# EAGLE design FrontPanel4 (EAGLE 9.2.2)
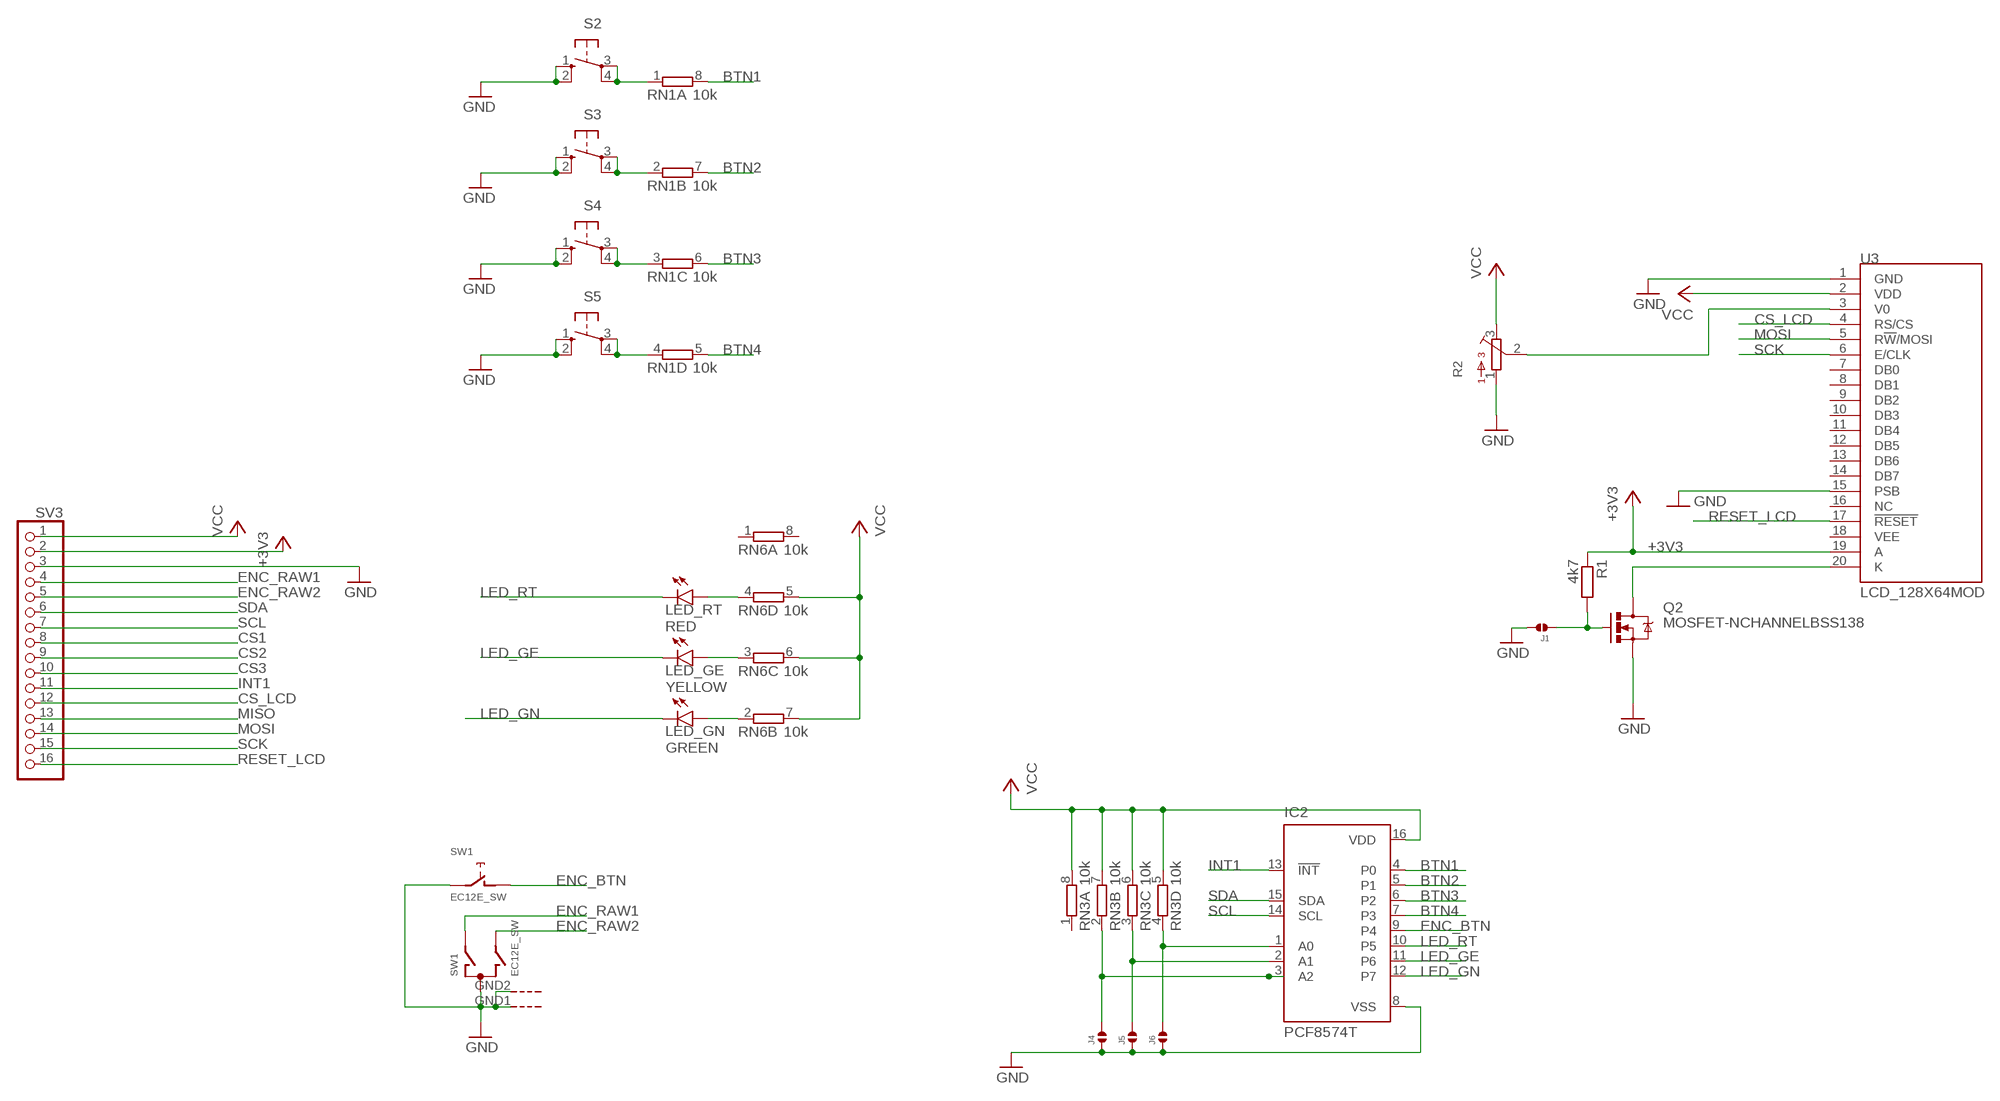
[diagram p0: schematic, sheet 1]

## Parts
IC2  PCF8574T  [SO16W]
J1  SOLDERJUMPER.2.MED  [2.MED]
J4  SOLDERJUMPER.2.MED  [2.MED]
J5  SOLDERJUMPER.2.MED  [2.MED]
J6  SOLDERJUMPER.2.MED  [2.MED]
LED_GE  YELLOW  LED5MM  [LED5MM]
LED_GN  GREEN  LED5MM  [LED5MM]
LED_RT  RED  LED5MM  [LED5MM]
Q2  MOSFET-NCHANNELBSS138  [SOT23]
R1  4k7  R-EU_R1206  [R1206]
R2  3362P  [3362P]
RN1  10k  4R-N0603-ARC  [0603-ARC]
RN3  10k  4R-N0603-ARC  [0603-ARC]
RN6  10k  4R-N0603-ARC  [0603-ARC]
S2  10-XX  [B3F-10XX]
S3  10-XX  [B3F-10XX]
S4  10-XX  [B3F-10XX]
S5  10-XX  [B3F-10XX]
SV3  PINHD-1X16  [1X16]
SW1  EC12E_SW  [ALPS_EC12E_SW]
U3  LCD_128X64MOD  [LCD_128X64_MOD]

## Nets
+3V3: R1.1 SV3.2 U3.19(A)
BTN1: IC2.4(P0) RN1.8
BTN2: IC2.5(P1) RN1.7
BTN3: IC2.6(P2) RN1.6
BTN4: IC2.7(P3) RN1.5
CS1: SV3.8
CS2: SV3.9
CS3: SV3.10
CS_LCD: SV3.12 U3.4(RS/CS)
ENC_BTN: IC2.9(P4) SW1.D
ENC_RAW1: SV3.4 SW1.A
ENC_RAW2: SV3.5 SW1.B
GND: IC2.8(VSS) J1.2 J4.1 J5.1 J6.1 Q2.2(S) R2.1 S2.1(S) S2.2(S1) S3.1(S) S3.2(S1) S4.1(S) S4.2(S1) S5.1(S) S5.2(S1) SV3.3 SW1.C SW1.E SW1.GND1(G) SW1.GND2(G) U3.1(GND) U3.15(PSB)
INT1: IC2.13(!INT) SV3.11
LED_GE: IC2.11(P6) LED_GE.K(C)
LED_GN: IC2.12(P7) LED_GN.K(C)
LED_RT: IC2.10(P5) LED_RT.K(C)
MISO: SV3.13
MOSI: SV3.14 U3.5(R!W!/MOSI)
N$1: R2.2 U3.3(V0)
N$3: RN1.1 S2.3(P) S2.4(P1)
N$4: RN1.2 S3.3(P) S3.4(P1)
N$5: RN1.3 S4.3(P) S4.4(P1)
N$6: R2.3 ; supply symbol labelled VCC
N$8: RN1.4 S5.3(P) S5.4(P1)
N$12: IC2.1(A0) J6.2 RN3.4
N$13: IC2.2(A1) J5.2 RN3.3
N$14: IC2.3(A2) J4.2 RN3.2
N$17: LED_RT.A RN6.4
N$18: LED_GE.A RN6.3
N$19: LED_GN.A RN6.2
N$21: Q2.3(D) U3.20(K)
N$23: J1.1 Q2.1(G) R1.2
RESET_LCD: SV3.16 U3.17(!RESET!)
SCK: SV3.15 U3.6(E/CLK)
SCL: IC2.14(SCL) SV3.7
SDA: IC2.15(SDA) SV3.6
VCC: IC2.16(VDD) RN3.5 RN3.6 RN3.7 RN3.8 RN6.5 RN6.6 RN6.7 SV3.1 U3.2(VDD)
Unconnected: RN3.1 RN6.1 RN6.8 U3.7(DB0) U3.8(DB1) U3.9(DB2) U3.10(DB3) U3.11(DB4) U3.12(DB5) U3.13(DB6) U3.14(DB7) U3.16(NC) U3.18(VEE)

## Library data of the parts
IC2 = micro-philips:PCF8574: I2C-Bus Remote 8-bit I/O expander http://www.semiconductors.philips.com/acrobat_download/datasheets/PCF8574_4.pdf; MPN: PCF8574T/3,512; OC_FARNELL: 1201255; OC_NEWARK: 70R6870
J1 J4-J6 = solderjumper:SOLDERJUMPER.2
LED_GE LED_GN LED_RT = led:LED: LED OSRAM: - CHIPLED LG R971, LG N971, LY N971, LG Q971, LY Q971, LO R971, LY R971 LH N974, LH R974 LS Q976, LO Q976, LY Q976 LO Q996 - Hyper CHIPLED LW Q18S LB Q993, LB Q99A, LB R99A - SideLED LS A670, LO A670, LY A670, LG A670, LP A670 LB A673, LV A673, LT A673, LW A673 LH A674 LY A675 LS A676, LA A676, LO A676, LY A676, LW A676 LS A679, LY A679, LG A679 - Hyper Micro SIDELED® LS Y876, LA Y876, LO Y876, LY Y876 LT Y87S - SmartLED LW L88C, LW L88S LB L89C, LB L89S, LG L890 LS L89K, LO L89K, LY L89K LS L896, LA L896, LO L896, LY L896 - TOPLED LS T670, LO T670, LY T670, LG T670, LP T670 LSG T670, LSP T670, LSY T670, LOP T670, LYG T670 LG T671, LOG T671, LSG T671 LB T673, LV T673, LT T673, LW T673 LH T674 LS T676, LA T676, LO T676, LY T676, LB T676, LH T676, LSB T676, LW T676 LB T67C, LV T67C, LT T67C, LS T67K, LO T67K, LY T67K, LW E67C LS E67B, LA E67B, LO E67B, LY E67B, LB E67C, LV E67C, LT E67C LW T67C LS T679, LY T679, LG T679 LS T770, LO T770, LY T770, LG T770, LP T770 LB T773, LV T773, LT T773, LW T773 LH T774 LS E675, LA E675, LY E675, LS T675 LS T776, LA T776, LO T776, LY T776, LB T776 LHGB T686 LT T68C, LB T68C - Hyper Mini TOPLED® LB M676 - Mini TOPLED Santana® LG M470 LS M47K, LO M47K, LY M47K Source: http://www.osram.convergy.de LUXEON: - LUMILED® LXK2-PW12-R00, LXK2-PW12-S00, LXK2-PW14-U00, LXK2-PW14-V00 LXK2-PM12-R00, LXK2-PM12-S00, LXK2-PM14-U00 LXK2-PE12-Q00, LXK2-PE12-R00, LXK2-PE12-S00, LXK2-PE14-T00, LXK2-PE14-U00 LXK2-PB12-K00, LXK2-PB12-L00, LXK2-PB12-M00, LXK2-PB14-N00, LXK2-PB14-P00, LXK2-PB14-Q00 LXK2-PR12-L00, LXK2-PR12-M00, LXK2-PR14-Q00, LXK2-PR14-R00 LXK2-PD12-Q00, LXK2-PD12-R00, LXK2-PD12-S00 LXK2-PH12-R00, LXK2-PH12-S00 LXK2-PL12-P00, LXK2-PL12-Q00, LXK2-PL12-R00 Source: www.luxeon.com KINGBRIGHT: KA-3528ASYC Source: www.kingbright.com
Q2 = BeagleBone_Blue_R3:MOSFET-NCHANNEL: Common NMOSFET Parts MFG P/N Store ID Prod ID FDD8780 TRANS-09984 SI7820DN TRANS-11055 FDS6630A IC-08089 2N7002PW TRANS-11151 FQP30N06L COM-10213 TRANS-10060 BSS123LT1G TRANS-08345 BSS138 TRANS-00830 BS170 2N7000; PROD_ID: TRANS-00830
R1 = rcl:R-EU_: RESISTOR, European symbol; SPICEPREFIX: R
R2 = bourns:3362: 3362 Series 1/4" Square Trimmer
RN1 RN3 RN6 = resistor-dil:4R-N: Array Chip Resistor Source: RS Component / Phycomp; OC_FARNELL: unknown; OC_NEWARK: unknown
S2-S5 = switch-omron:10-XX: OMRON SWITCH; MPN: B3F-1000; OC_FARNELL: 176432; OC_NEWARK: 36M3542
SV3 = pinhead:PINHD-1X16: PIN HEADER
SW1 = switch-alps:EC12E_SW: ALPS rotary Encoder EC12E series with switch; MPN: EC12E2424407; OC_FARNELL: 1520813; OC_NEWARK: 74M1068
U3 = custom:LCD_128X64

## Net classes
0 default: width 0.127 mm, drill 0.2 mm, clearance 0.127 mm

## Board
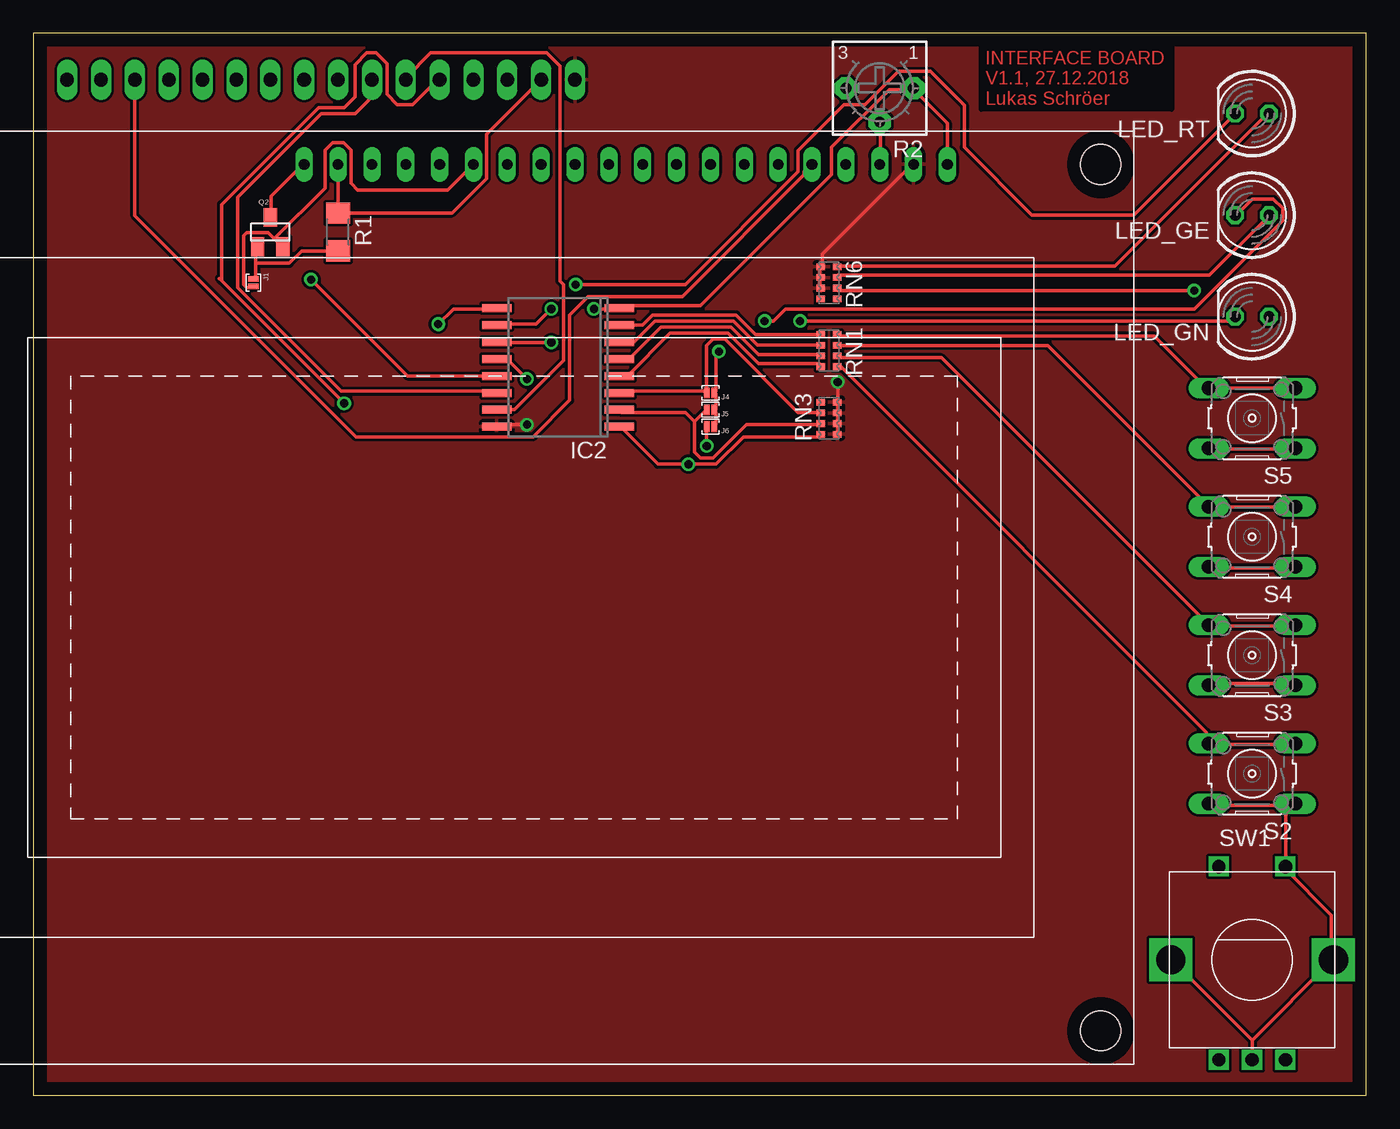
[diagram p1: board, top side]
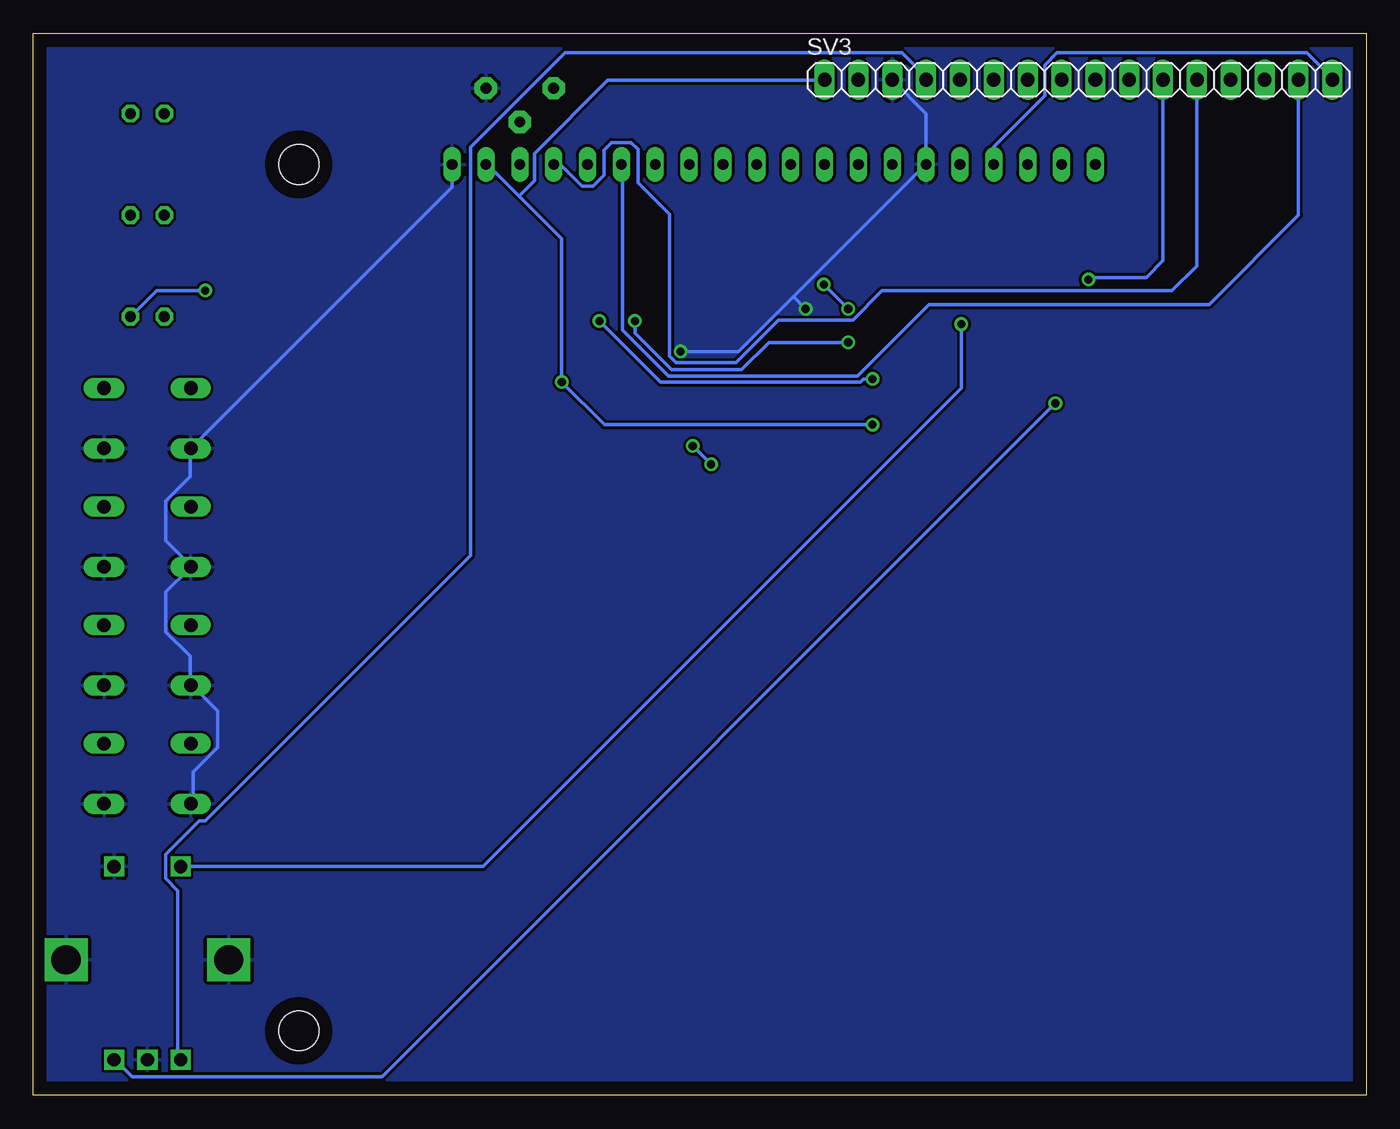
[diagram p2: board, bottom side, seen from below]

Size 100 x 79.68 mm. Coordinates in mm from the lower left corner, seen from the top.
Outline: 0,0 100,0 100,79.68 0,79.68 0,0
Copper layers (1*16): Top 0.035mm / dielectric 1.5mm / Bottom 0.035mm
Design rules "default *": minimum track width 10mil, minimum drill 24mil, track to track 8mil, track to pad 8mil, pad to pad 8mil, via to via 8mil, smd to smd 8mil, copper to edge 40mil, drill to drill 8mil, minimum pad ring 10mil, minimum via ring 8mil, stop-mask expansion 4mil, vias tented up to drill 0mil, thermal gap 10mil

### Footprints (pad centres in the part's own frame; a part is rotated, then mirrored left to right if it is on the bottom)
SO16W = smd 0.6 x 2.2: 1 -4.445,-4.6; 2 -3.175,-4.6; 3 -1.905,-4.6; 4 -0.635,-4.6; 5 0.635,-4.6; 6 1.905,-4.6; 7 3.175,-4.6; 8 4.445,-4.6; 9 4.445,4.6; 10 3.175,4.6; 11 1.905,4.6; 12 0.635,4.6; 13 -0.635,4.6; 14 -1.905,4.6; 15 -3.175,4.6; 16 -4.445,4.6
2.MED = smd 0.406 x 0.813: 1 -0.279,0; 2 0.279,0
LED5MM = drill 0.813 octagon: A -1.27,0; K 1.27,0
SOT23 = smd 1 x 1.4: 1 -0.95,-1.1; 2 0.95,-1.1; 3 0,1.1
R1206 = smd 1.6 x 1.803: 1 -1.422,0; 2 1.422,0
3362P = drill 0.813 pad 1.676 octagon: 1 -2.54,0; 2 0,2.54; 3 2.54,0
0603-ARC = smd 0.5 x 0.65: 1 -1.2,-0.625; 2 -0.4,-0.625; 3 0.4,-0.625; 4 1.2,-0.625; 5 1.2,0.625; 6 0.4,0.625; 7 -0.4,0.625; 8 -1.2,0.625
B3F-10XX = drill 1.016 long: 1 -3.251,2.261; 2 3.251,2.261; 3 -3.251,-2.261; 4 3.251,-2.261
1X16 = drill 1.016 long: 1 -19.05,0; 2 -16.51,0; 3 -13.97,0; 4 -11.43,0; 5 -8.89,0; 6 -6.35,0; 7 -3.81,0; 8 -1.27,0; 9 1.27,0; 10 3.81,0; 11 6.35,0; 12 8.89,0; 13 11.43,0; 14 13.97,0; 15 16.51,0; 16 19.05,0
ALPS_EC12E_SW = drill 1 square: A -2.5,-7.5; B 2.5,-7.5; C 0,-7.5; D -2.5,7; E 2.5,7 | drill 2.2 square: GND1 -6.1,0; GND2 6.1,0
LCD_128X64_MOD = drill 0.8 long: 1 0,0.01; 2 2.54,0; 3 5.08,0; 4 7.62,0; 5 10.16,0; 6 12.7,0; 7 15.24,0; 8 17.78,0; 9 20.32,0; 10 22.86,0; 11 25.4,0; 12 27.94,0; 13 30.48,0; 14 33.02,0; 15 35.56,0; 16 38.1,0; 17 40.64,0; 18 43.18,0; 19 45.72,0; 20 48.26,0 | hole 3: -11.5,65.01; -11.5,0.01

### Placement (x,y rotation side)
IC2  39.37,54.61 90 top
J1  16.51,60.96 270 top
J4  50.8,52.7 180 top
J5  50.8,51.44 180 top
J6  50.8,50.16 180 top
LED_GE  91.44,66.04 180 top
LED_GN  91.44,58.42 180 top
LED_RT  91.44,73.66 180 top
Q2  17.78,64.77 0 top
R1  22.86,64.77 270 top
R2  63.5,75.56 180 top
RN1  59.69,55.88 90 top
RN3  59.69,50.8 270 top
RN6  59.69,60.96 90 top
S2  91.44,24.13 180 top
S3  91.44,33.02 180 top
S4  91.44,41.91 180 top
S5  91.44,50.8 180 top
SV3  21.59,76.2 0 bottom
SW1  91.44,10.16 0 top
U3  68.58,69.85 180 top

### Tracks (layer width: path | path; a pad name or v marks a point on that pad's centre or on a via)
+3V3
  Top 0.254: 38.05,75.01 38.05,76.15 | 38.05,76.15 SV3.2 | 22.86,69.98 U3.19 R1.1 31.41,66.19 34,68.79 34,72.1 38.05,76.15
BTN1
  Top 0.254: IC2.4 44.58,53.98 47.78,57.17 52.12,57.17 54.41,54.89 58.98,54.89 RN1.8
BTN2
  Top 0.254: RN1.7 58.98,55.58 54.41,55.58 52.35,57.63 47.09,57.63 44.81,55.35 44.12,55.35 IC2.5
BTN3
  Top 0.254: IC2.6 45.09,56.52 46.66,58.09 52.54,58.09 54.35,56.28 RN1.6
BTN4
  Top 0.254: IC2.7 45.71,57.78 46.47,58.55 52.73,58.55 54.2,57.08 RN1.5
CS_LCD
  Bottom 0.254: U3.4 60.47,69.85 58.83,68.21 58.01,68.21 57.18,69.04 57.18,70.91 56.6,71.49 55.16,71.49 54.64,70.97 54.64,68.47 52.27,66.1 52.27,55.46 51.78,54.97 47.28,54.97 44.08,58.17 38.52,58.17 36.32,60.36 14.57,60.36 12.7,62.23 SV3.12
ENC_BTN  (via drill 0.61)
  Top 0.254: v30.38,57.86 31.52,59 34.75,59 IC2.9
  Bottom 0.254: v30.38,57.86 30.38,53.06 66.27,17.17 88.92,17.17 SW1.D
ENC_RAW1
  Bottom 0.254: SW1.A 89.15,2.77 89.15,15.34 90.07,16.26 90.07,18.09 87.55,20.6 87.1,20.6 67.21,40.49 67.21,71.12 60.12,78.21 34.85,78.21 33.02,76.38 SV3.4
ENC_RAW2  (via drill 0.61)
  Top 0.254: 13.95,61.29 14.12,61.11 | 14.12,61.11 v23.32,51.92 | SV3.5 30.28,76.15 28.45,74.32 27.3,74.32 26.53,75.09 26.53,77.38 25.7,78.21 25.02,78.21 24.13,77.32 24.13,74.93 23.32,74.12 21.4,74.12 14.12,66.84 14.12,61.11
  Bottom 0.254: v23.32,51.92 73.84,1.4 92.58,1.4 93.73,2.54 SW1.B
GND  (via drill 0.61)
  Top 0.254: 18.06,64.26 18.52,63.8 Q2.2 | 18.06,64.26 17.6,64.72 16,64.72 15.77,64.49 15.77,60.83 16,60.6 16.46,60.6 J1.2 | 35.53,76.15 SV3.3 | J6.1 51.21,50.32 51.21,51.23 J5.1 51.21,51.46 51.21,52.6 J4.1 51.21,52.83 51.21,55.58 v51.44,55.8 | v42.06,59 43.89,59 IC2.8 44.12,59.23 50.06,59.23 59.89,69.06 59.89,71.12 64.24,75.46 65.84,75.46 R2.1 66.06,75.46 68.58,72.95 U3.1 | 91.44,4.14 SW1.C | 91.44,4.14 85.5,10.08 SW1.GND1 | 93.95,21.06 93.95,17.17 SW1.E 93.95,16.94 97.38,13.51 97.38,10.31 SW1.GND2 97.38,10.08 91.44,4.14 | 93.95,21.06 94.64,21.74 S2.1 | 93.95,21.06 93.27,21.74 88.24,21.74 S2.2 | S5.2 88.24,48.49 94.64,48.49 S5.1 | S3.2 88.24,30.89 94.64,30.89 S3.1 | S4.2 88.24,39.57 94.64,39.57 S4.1 | U3.15 31.09,67.92 24.34,67.92 23.84,68.42 23.84,70.91 23.27,71.49 22.45,71.49 21.88,70.91 21.88,68.08 18.06,64.26
  Bottom 0.254: v51.44,55.8 47.09,55.8 42.98,59.92 | 42.98,59.92 33.15,69.75 U3.15 33.02,73.66 SV3.3 | 42.98,59.92 v42.06,59 | U3.1 68.58,68.15 S5.2 88.24,48.49 88.24,46.43 90.07,44.6 90.07,41.63 88.24,39.8 S4.2 88.24,39.57 90.07,37.74 90.07,34.77 88.24,32.94 88.24,30.89 S3.2 88.01,30.66 86.18,28.83 86.18,26.09 88.01,24.26 88.01,21.97 S2.2
  pour Bottom (rank 2): -15.24,83.5 105.41,83.5 105.41,-6.35 -15.24,-6.35
INT1  (via drill 0.61)
  Top 0.254: IC2.13 28.07,53.98 v20.84,61.2
  Bottom 0.254: v20.84,61.2 20.7,61.34 16.51,61.34 15.24,62.61 SV3.11
LED_GE  (via drill 0.61)
  Top 0.254: v38.86,56.49 34.98,56.49 IC2.11 | v54.86,58.09 55.52,58.09 56.44,59 87.1,59 93.73,65.63 93.73,66.55 93.04,67.23 91.44,67.23 90.3,66.09 LED_GE.K
  Bottom 0.254: v38.86,56.49 44.81,56.49 46.86,54.43 52.12,54.43 54.86,57.17 v54.86,58.09
LED_GN  (via drill 0.61)
  Top 0.254: v37.03,53.75 35.66,55.12 34.98,55.12 IC2.12 | v57.53,58.09 89.84,58.09 LED_GN.K
  Bottom 0.254: v37.03,53.75 37.72,53.75 37.95,53.52 52.96,53.52 v57.53,58.09
LED_RT  (via drill 0.61)
  Top 0.254: v38.86,59 37.72,57.86 34.98,57.86 IC2.10 | v40.69,60.83 48.92,60.83 57.38,69.29 57.38,70.89 60.81,74.32 62.41,74.32 64.92,76.83 67.31,76.83 69.85,74.3 69.85,71.12 74.93,66.04 82.55,66.04 LED_RT.K
  Bottom 0.254: v40.69,60.83 v38.86,59
MOSI
  Top 0.254: U3.5 58.29,69.75 57.84,69.29 57.84,69.06 48.69,59.92 41.6,59.92 40.23,58.55 40.23,52.15 37.49,49.4 24.23,49.4 7.62,66.02 SV3.14 7.64,76.15
N$1
  Top 0.254: U3.3 63.55,69.98 63.55,72.95 R2.2
N$3
  Top 0.254: RN1.1 60.35,54.66 60.58,54.66 88.01,27.23 88.01,26.54 S2.4 88.24,26.31 94.64,26.31 S2.3
N$4
  Top 0.254: RN1.2 60.35,55.35 68.12,55.35 S3.4 88.24,35.23 94.64,35.23 S3.3
N$5
  Top 0.254: RN1.3 60.35,56.26 76.12,56.26 88.01,44.37 S4.4 88.24,44.15 94.64,44.15 S4.3
N$8
  Top 0.254: RN1.4 60.35,56.95 84.12,56.95 88.01,53.06 S5.4 S5.3
N$12  (via drill 0.61)
  Top 0.254: RN3.4 58.98,49.4 53.26,49.4 51.21,47.35 v49.15,47.35 46.86,47.35 44.12,50.09 IC2.1 | v50.52,48.72 J6.2
  Bottom 0.254: v49.15,47.35 v50.52,48.72
N$13
  Top 0.254: 49.61,50.55 49.61,48.26 50.06,47.8 50.98,47.8 53.49,50.32 58.98,50.32 RN3.3 | 49.61,50.55 50.52,51.46 J5.2 | 49.61,50.55 48.92,51.23 44.12,51.23 IC2.2
N$14
  Top 0.254: 50.52,52.83 50.52,56.26 50.98,56.72 51.89,56.72 57.38,51.23 58.98,51.23 RN3.2 | 50.52,52.83 44.12,52.83 IC2.3 | 50.52,52.83 J4.2
N$17
  Top 0.254: RN6.4 60.35,62.2 81.15,62.2 92.58,73.64 LED_RT.A
N$18
  Top 0.254: RN6.3 60.35,61.52 88.24,61.52 92.58,65.86 LED_GE.A
N$19  (via drill 0.61)
  Top 0.254: v87.1,60.38 60.35,60.38 RN6.2
  Bottom 0.254: v87.1,60.38 90.75,60.38 LED_GN.A
N$21
  Top 0.254: Q2.3 17.83,66.09 17.83,67.46 20.12,69.75 U3.20
N$23
  Top 0.254: 16.69,62.43 16.69,63.58 Q2.1 | 16.69,62.43 16.69,61.29 J1.1 | R1.2 20.12,63.35 19.2,62.43 16.69,62.43 | R1.2
NONE
  cutout Top: 71.12,78.74 85.41,78.74 85.41,73.98 71.12,73.98
RESET_LCD
  Bottom 0.254: SV3.16 2.62,76.38 4.45,78.21 23.19,78.21 24.11,77.29 24.11,75.01 27.94,71.17 U3.17
SCK
  Bottom 0.254: U3.6 55.78,69.75 55.78,57.4 52.35,53.98 38.18,53.98 32.82,59.33 11.79,59.33 5.08,66.04 SV3.15
SCL
  Top 0.254: IC2.14 34.75,52.83 23.09,52.83 15.32,60.6 15.32,67.39 21.59,73.66 24.13,73.66 25.4,74.93 SV3.7
SDA
  Top 0.254: IC2.15 34.98,51.46 36.12,51.46 39.78,55.12 39.78,60.83 39.51,61.1 39.51,77.2 38.51,78.21 29.82,78.21 27.99,76.38 SV3.6
VCC  (via drill 0.61)
  Top 0.254: RN3.5 60.35,49.63 60.35,50.32 RN3.6 60.35,50.55 60.35,51 RN3.7 60.35,51.23 60.35,51.92 RN3.8 60.35,52.15 v60.35,53.52 | RN6.7 58.98,60.6 58.98,61.29 RN6.6 58.98,61.52 58.98,61.98 RN6.5 59.21,62.2 59.21,63.12 65.84,69.75 U3.2 | v37.03,50.32 34.98,50.32 IC2.16
  Bottom 0.254: 63.55,67.46 65.84,69.75 U3.2 | 63.55,67.46 60.35,64.26 v60.35,53.52 57.15,50.32 v37.03,50.32 | 63.55,67.46 62.41,68.61 62.41,70.66 56.92,76.15 40.79,76.15 SV3.1
  pour Top: -15.24,83.5 105.41,83.5 105.41,-6.35 -15.24,-6.35

### Text on the board
Top: INTERFACE BOARD / V1.1, 27.12.2018 / Lukas Schröer
tStop: INTERFACE BOARD / V1.1, 27.12.2018 / Lukas Schröer